# Altium schematic sheet Display.SchDoc
size A; SheetNumber: 1; SheetTotal: 2
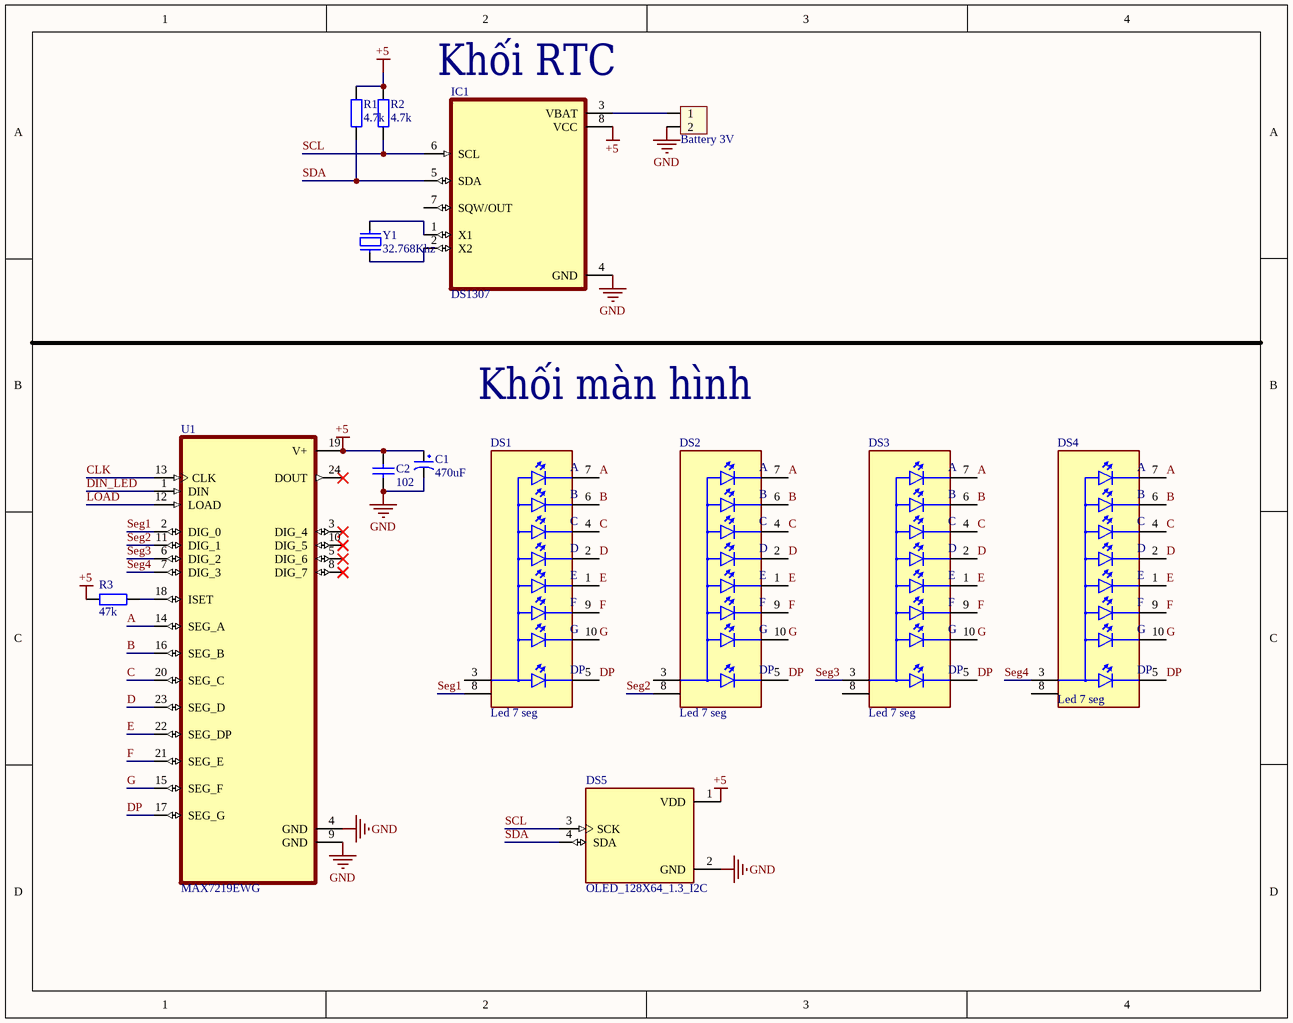
[diagram p0: Display.SchDoc]

## Parts
C1  470uF  [TU HOA 8mm]
C2  102  [tu 1206]
DS1  Led 7 seg  [2.3_7-SEG_DIS]
DS2  Led 7 seg  [2.3_7-SEG_DIS]
DS3  Led 7 seg  [2.3_7-SEG_DIS]
DS4  Led 7 seg  [2.3_7-SEG_DIS]
DS5  OLED_128X64_1.3_I2C  [LCD_OLED_128X64_1.3_I2C]
H1  Battery 3V  [Header 2P DC 2.54]
IC1  DS1307  [DIP794W47P254L991H457Q8]
R1  4.7k  [tro smd 1206]
R2  4.7k  [tro smd 1206]
R3  47k  [tro smd 1206]
U1  MAX7219EWG  [DIP794W47P254L3054H457Q24]
Y1  32.768Khz  [Thach Anh 2 Chan 32,768 KHz]

## Nets
+5: C1.1 C2.1 DS5.1(VDD) IC1.8(VCC) R1.2 R2.2 R3.2 U1.19(V+)
GND: C1.2 C2.2 DS5.2(GND) H1.2 IC1.4(GND) U1.4(GND) U1.9(GND)
A: DS1.7(A) DS2.7(A) DS3.7(A) DS4.7(A) U1.14(SEG_A)
B: DS1.6(B) DS2.6(B) DS3.6(B) DS4.6(B) U1.16(SEG_B)
C: DS1.4(C) DS2.4(C) DS3.4(C) DS4.4(C) U1.20(SEG_C)
CLK: U1.13(CLK)
D: DS1.2(D) DS2.2(D) DS3.2(D) DS4.2(D) U1.23(SEG_D)
DIN_LED: U1.1(DIN)
DP: DS1.5(DP) DS2.5(DP) DS3.5(DP) DS4.5(DP) U1.17(SEG_G)
E: DS1.1(E) DS2.1(E) DS3.1(E) DS4.1(E) U1.22(SEG_DP)
F: DS1.9(F) DS2.9(F) DS3.9(F) DS4.9(F) U1.21(SEG_E)
G: DS1.10(G) DS2.10(G) DS3.10(G) DS4.10(G) U1.15(SEG_F)
LOAD: U1.12(LOAD)
SCL: DS5.3(SCK) IC1.6(SCL) R2.1
SDA: DS5.4(SDA) IC1.5(SDA) R1.1
Seg1: DS1.8(COM) U1.2(DIG_0)
Seg2: DS2.8(COM) U1.11(DIG_1)
Seg3: DS3.3(COM) U1.6(DIG_2)
Seg4: DS4.3(COM) U1.7(DIG_3)
NetH1_1: H1.1 IC1.3(VBAT)
NetIC1_1: IC1.1(X1) Y1.2
NetIC1_2: IC1.2(X2) Y1.1
NetR3_1: R3.1 U1.18(ISET)

Not connected (* = marked no-connect by the designer): DS1 3(COM); DS2 3(COM); DS3 8(COM); DS4 8(COM); IC1 7(SQW/OUT); U1 3(DIG_4)* 5(DIG_6)* 8(DIG_7)* 10(DIG_5)* 24(DOUT)*

## Notes on the sheet
- (near IC1) Khối RTC
- Khối màn hình

## Library data of the parts
C1 = Tu Hoa 470uF 50V 10x17: Cắm; Don_Vi: Con; So_Chan: 2; Ten_Linh_Kien: Tụ Hóa 470uF 50V; Ma_Hang: MH006866; Chung_Loai: Cắm; Kieu_Chan: *
C2 = Tu 1206 102 50V 10%: Dán; Don_Vi: Con; So_Chan: 2; Ten_Linh_Kien: Tụ 1206 102-1nF 10% 50V; Ma_Hang: MH004542; Chung_Loai: Dán; Kieu_Chan: *
DS1-DS4 = HDSP-511Y: Display Modules - LED Character and Numeric Yellow 7-Segment 1 Character Common Anode 2.15V 20mA 0.673 H x 0.488 W x 0.315 D (17.10mm x 12.40mm x 8.00mm) 10-DIP (0.600, 15.24mm); MF: Broadcom Limited; SnapEDA_Link: https://www.snapeda.com/parts/HDSP-511Y/Broadcom+Limited/view-part/?ref=snap; Check_prices: https://www.snapeda.com/parts/HDSP-511Y/Broadcom+Limited/view-part/?ref=eda; Value: *; Price: None; Availability: Not in stock; MP: HDSP-511Y; Package: None
DS5 = OLED_128X64_1.3_I2C: Non-Touch Graphic LCD Display Module Transmissive White OLED, Monochrome I2C 1.3 (33.02mm) 128 x 64; MF: UNIVERSAL-SOLDER Electronics Ltd; MP: OLED 128x64 1.3&quot; I2C; SnapEDA_Link: https://www.snapeda.com/parts/OLED%20128x64%201.3%22%20I2C/UNIVERSAL-SOLDER+Electronics+Ltd/view-part/?ref=snap; Package: None; Value: *; Check_prices: https://www.snapeda.com/parts/OLED%20128x64%201.3%22%20I2C/UNIVERSAL-SOLDER+Electronics+Ltd/view-part/?ref=eda
H1 = Header 2P 2.54 Duc Cong: Cắm; Ten_Linh_Kien: Header 2P XH2.54-2P Đực Cong; Don_Vi: Con; Ma_Hang: MH002852; Chung_Loai: Cắm
IC1 = DS1307: Real Time Clock (RTC) IC Clock/Calendar 56B IÂ²C, 2-Wire Serial 8-SOIC (0.154, 3.90mm Width); MF: Maxim Integrated; MP: DS1307; Price: None; Purchase-URL: https://pricing.snapeda.com/search/part/DS1307/?ref=eda; Package: DIP-8 Maxim Integrated; Check_prices: https://www.snapeda.com/parts/DS1307/Maxim+Integrated/view-part/?ref=eda; Value: *; Availability: In Stock; SnapEDA_Link: https://www.snapeda.com/parts/DS1307/Maxim+Integrated/view-part/?ref=snap
R1-R3 = Tro 1206 5% 1k: Dán; Don_Vi: Con; So_Chan: 2; Ten_Linh_Kien: Trở 1206 5% 1k; Ma_Hang: MH005904; Chung_Loai: Dán; Kieu_Chan: *
U1 = MAX7219EWG: LED Driver 64 Segment 330000uA Supply Current 24-Pin SOIC W Tube; MF: Analog Devices; MP: MAX7219EWG+; SnapEDA_Link: https://www.snapeda.com/parts/MAX7219EWG+/Analog+Devices/view-part/?ref=snap; Package: SOIC-24 Maxim; Value: *; Check_prices: https://www.snapeda.com/parts/MAX7219EWG+/Analog+Devices/view-part/?ref=eda
Y1 = Thach Anh 2 chan Cam: Crystal For all Crystal 2pin.; Value: 4Mhz